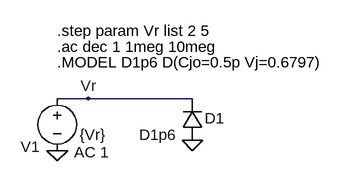
[diagram p0: schematic 4-6-b-1.asc]
4-6-b-1.asc, the LTspice schematic file:
Version 4
SHEET 1 880 680
WIRE 192 80 144 80
WIRE 352 80 192 80
FLAG 144 160 0
FLAG 352 144 0
FLAG 192 80 Vr
SYMBOL diode 368 144 R180
WINDOW 0 -34 34 Left 2
WINDOW 3 40 8 Left 2
SYMATTR InstName D1
SYMATTR Value D1p6
SYMBOL voltage 144 64 R0
WINDOW 0 -56 90 Left 2
WINDOW 3 35 72 Left 2
WINDOW 123 26 99 Left 2
WINDOW 39 0 0 Left 2
SYMATTR InstName V1
SYMATTR Value {Vr}
SYMATTR Value2 AC 1
TEXT 144 24 Left 2 !.MODEL D1p6 D(Cjo=0.5p Vj=0.6797)
TEXT 144 -24 Left 2 !.step param Vr list 2 5
TEXT 144 0 Left 2 !.ac dec 1 1meg 10meg

The netlist it stands for:
* 4-6-b-1.asc
D1 0 Vr D1p6
V1 Vr 0 {Vr} AC 1
.model D D
.lib standard.dio
.MODEL D1p6 D(Cjo=0.5p Vj=0.6797)
.step param Vr list 2 5
.ac dec 1 1meg 10meg
.backanno
.end